# Altium schematic sheet Control_Part_V1.1_Page2.SchDoc
size A4; SheetNumber: 2; SheetTotal: 2
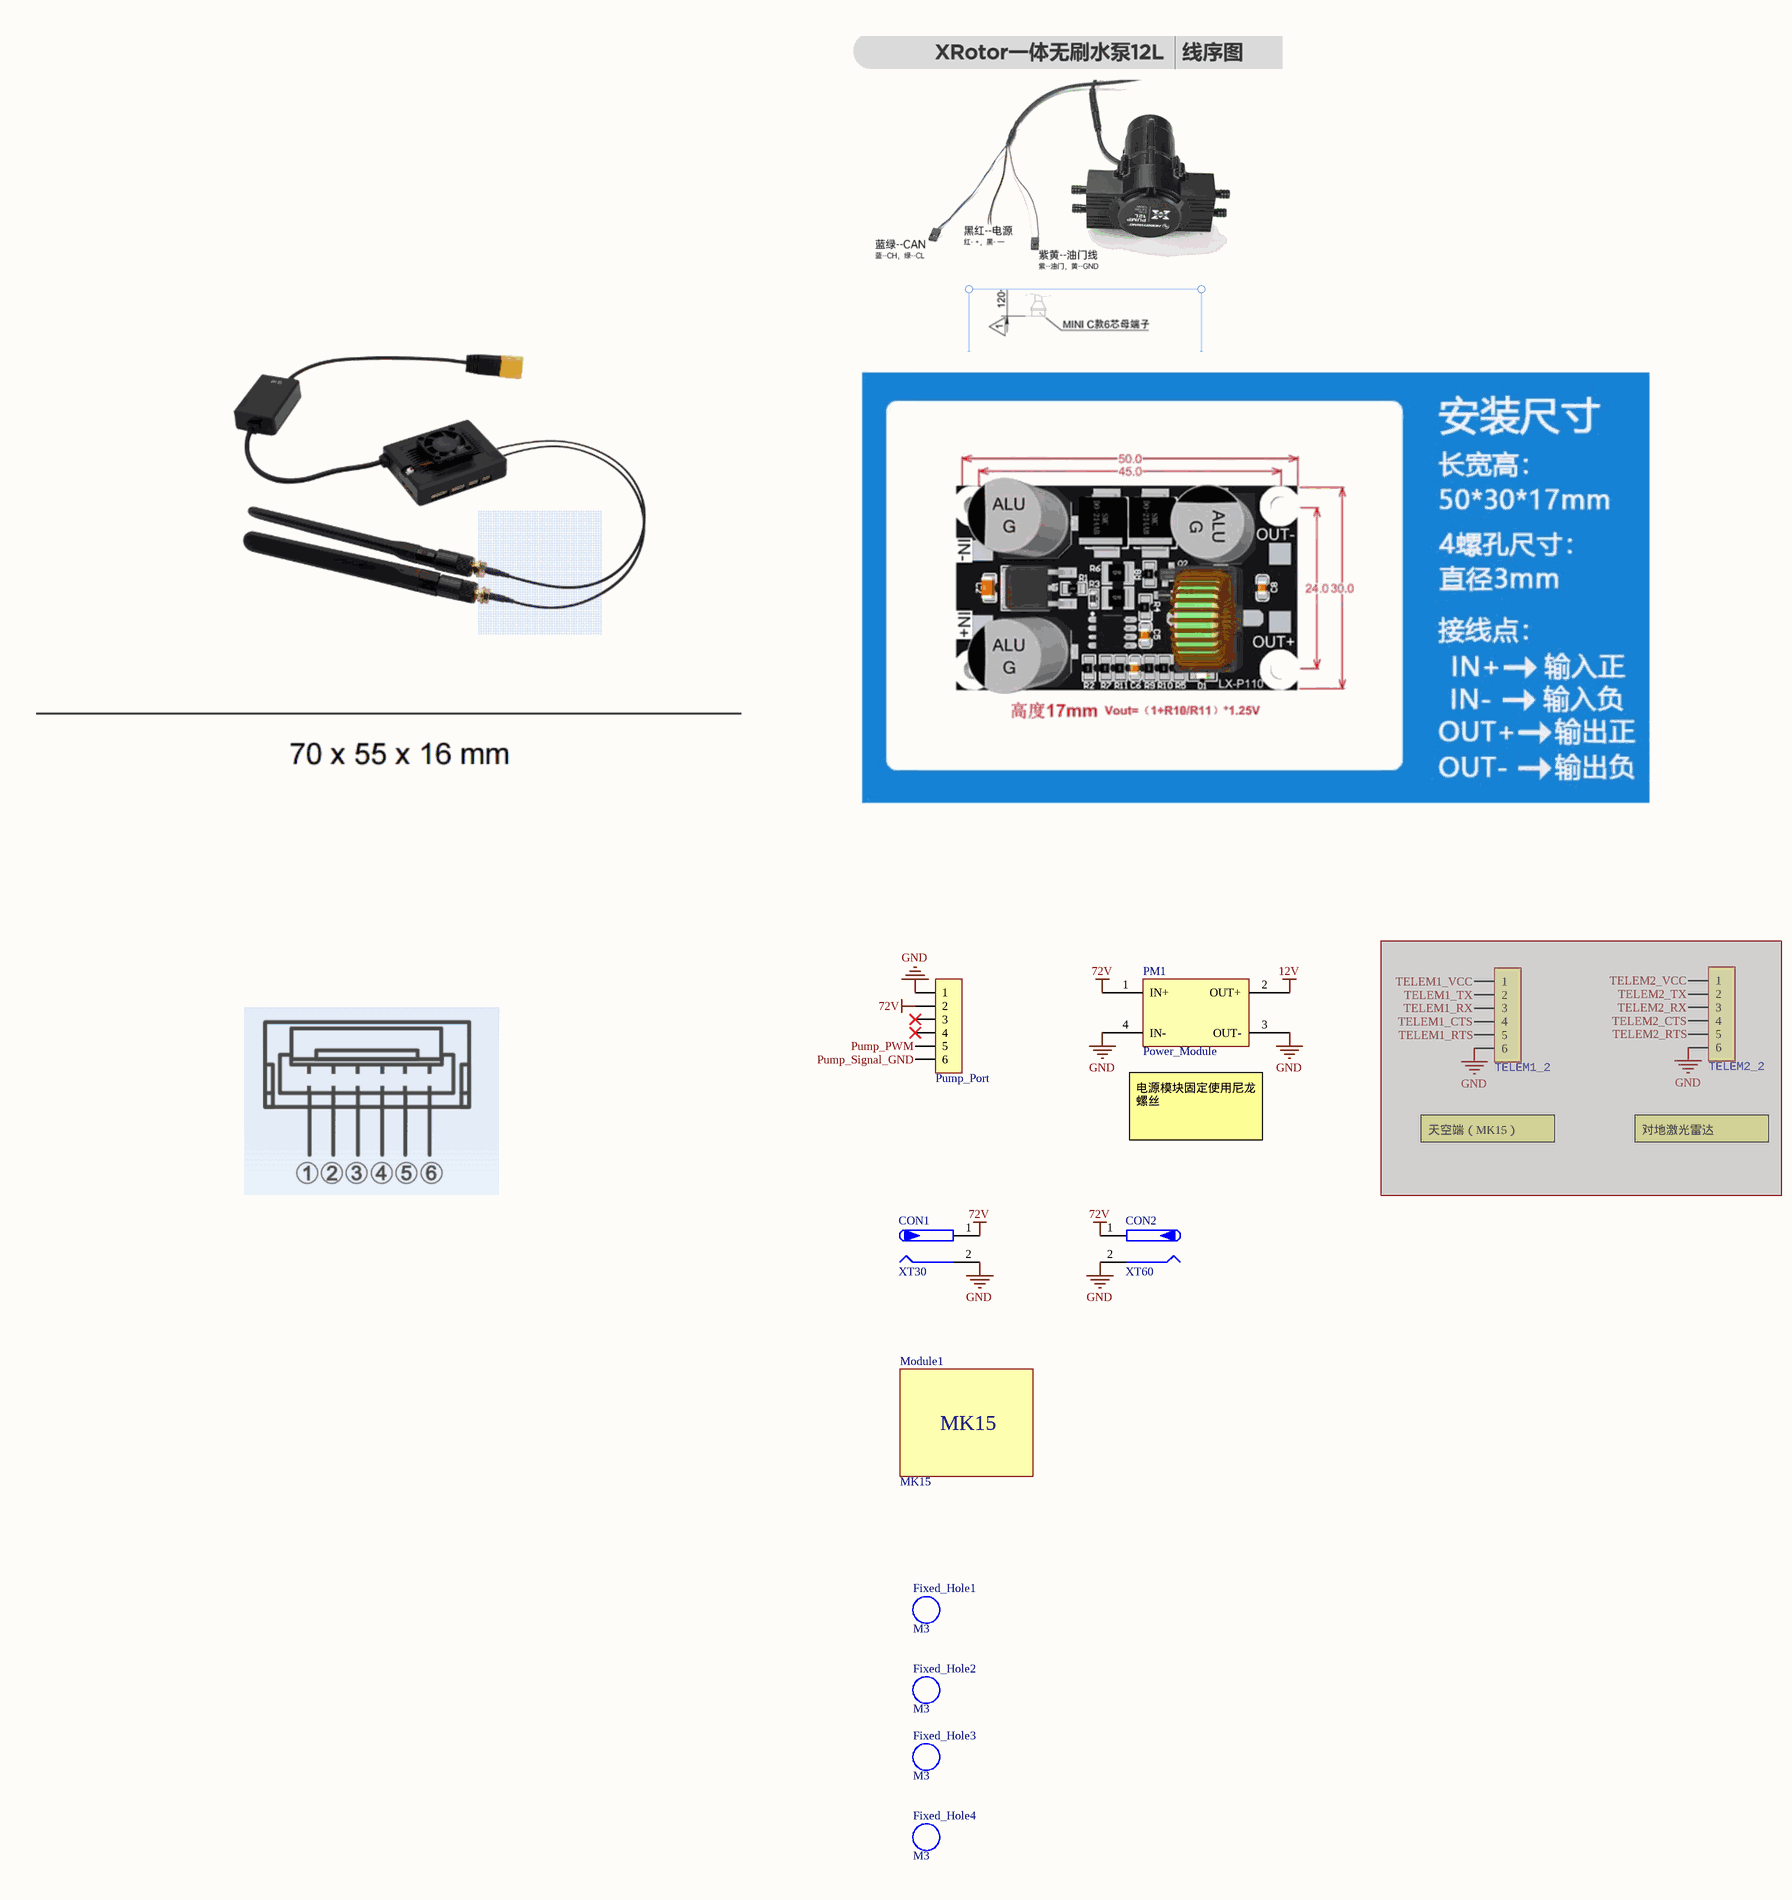
[diagram p0: Control_Part_V1.1_Page2.SchDoc, left]
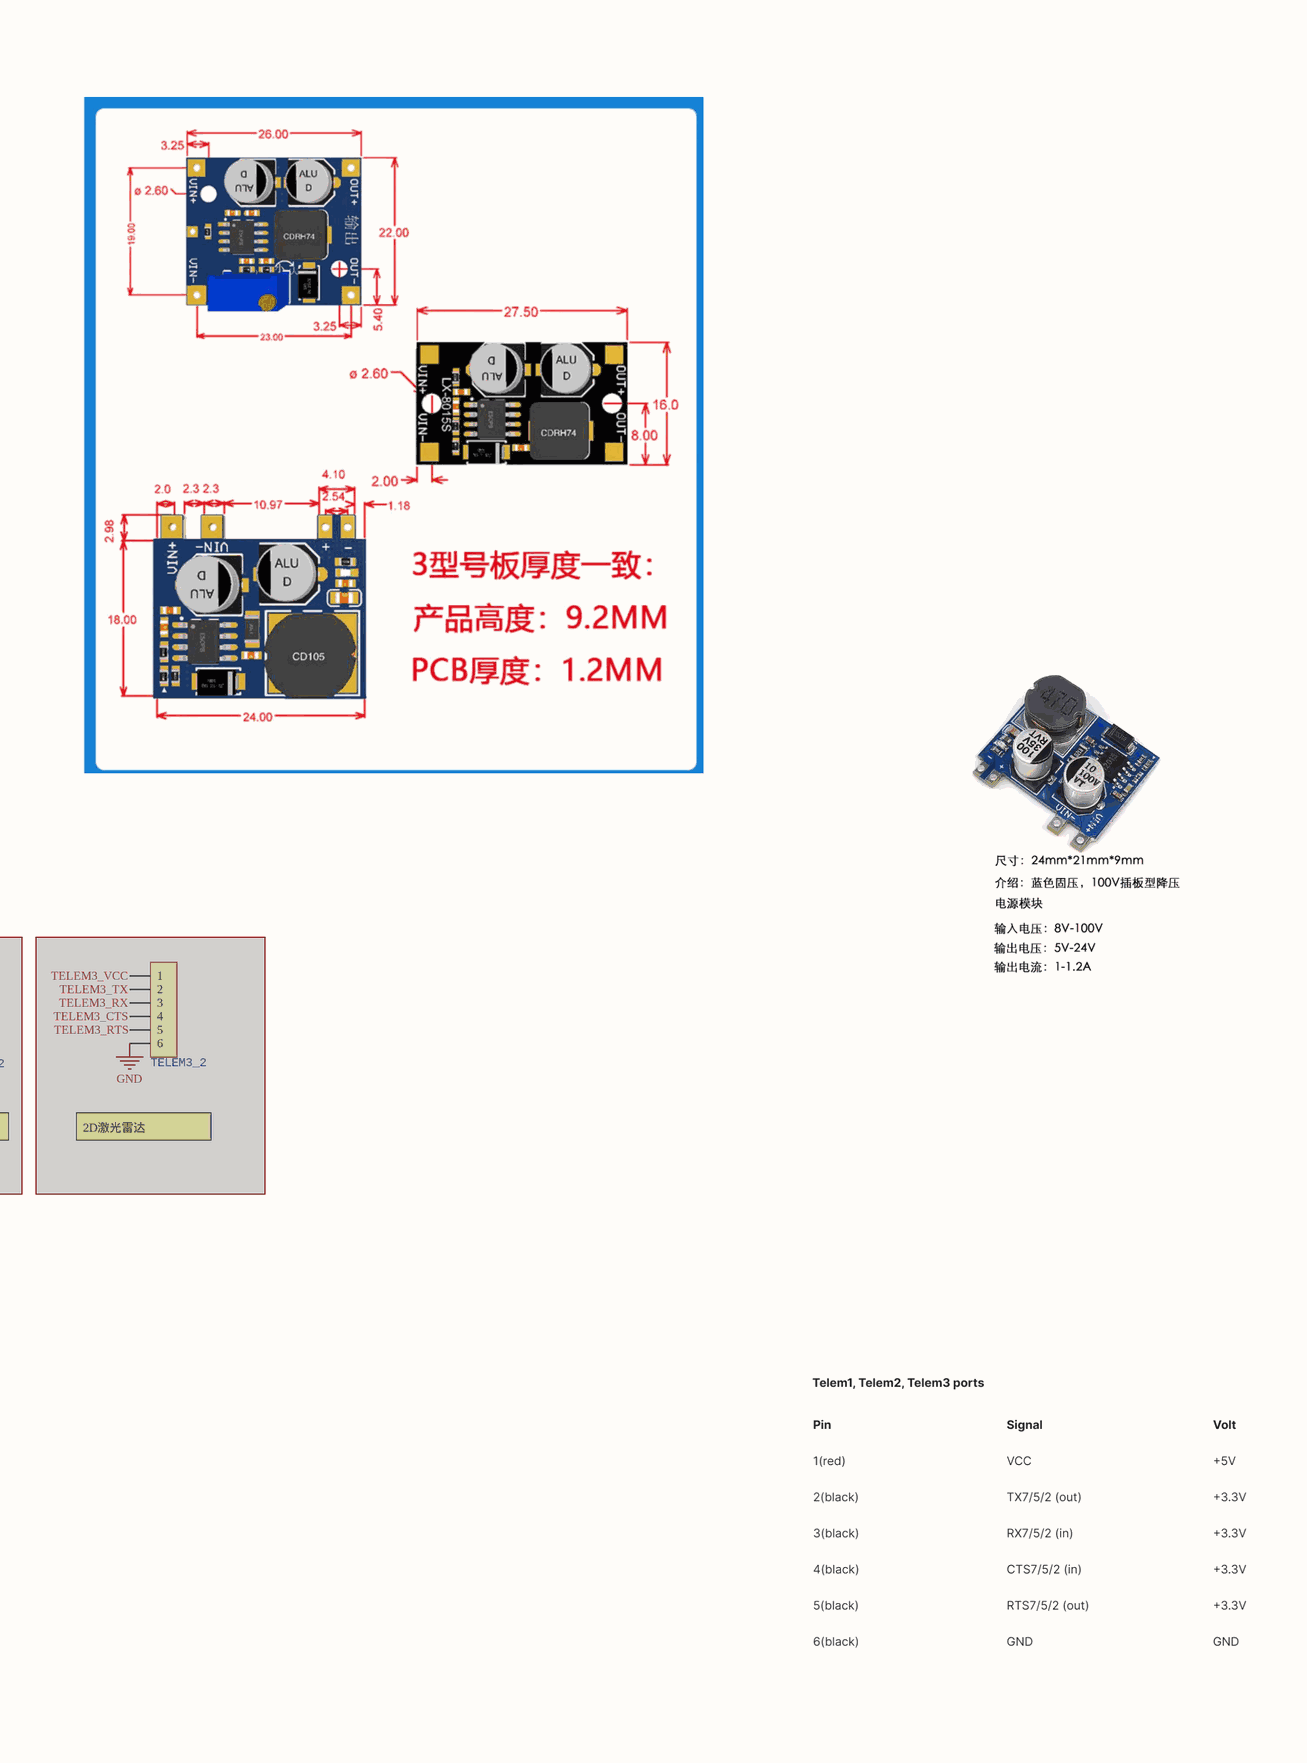
[diagram p1: Control_Part_V1.1_Page2.SchDoc, right]

## Parts
CON1  XT30  [XT30U-M]
CON2  XT60  [TX60U-F]
Fixed_Hole1  M3  [M3 140X350]
Fixed_Hole2  M3  [M3 140X350]
Fixed_Hole3  M3  [M3 140X350]
Fixed_Hole4  M3  [M3 140X350]
Module1  MK15  [MK15]
PM1  Power_Module  [PCBComponent_1]
Pump_Port  HDR-1X6  [HDR2.54-LI-6P]  (value not drawn)
TELEM1_2  HDR-1X6  [GH1.25-LS-6P]  (value not drawn)  (masked out: inside a compile mask, not in the netlist)
TELEM2_2  HDR-1X6  [GH1.25-LS-6P]  (value not drawn)  (masked out: inside a compile mask, not in the netlist)
TELEM3_2  HDR-1X6  [GH1.25-LS-6P]  (value not drawn)  (masked out: inside a compile mask, not in the netlist)

## Nets
12V: PM1.2(OUT+)
72V: CON1.1 CON2.1 PM1.1(IN+) Pump_Port.2
GND: CON1.2 CON2.2 PM1.3(OUT-) PM1.4(IN-) Pump_Port.1
Pump_PWM: Pump_Port.5
Pump_Signal_GND: Pump_Port.6

Not connected (* = marked no-connect by the designer): Pump_Port 3* 4*

## Notes on the sheet
- (near PM1) 电源模块固定使用尼龙螺丝
- 天空端（MK15）
- 对地激光雷达
- 2D激光雷达

## Library data of the parts
CON1 CON2 = XT电源接口-2Pins: 电源接口; BOM名称: XT航模电源接口
Fixed_Hole1-Fixed_Hole4 = M3: 铜柱孔; BOM名称: 铜柱孔
Pump_Port TELEM1_2 TELEM2_2 TELEM3_2 = Header 6: 6P接插件; BOM名称: 6P接插件